# EAGLE design nunchuk-v01 (EAGLE 5.09)
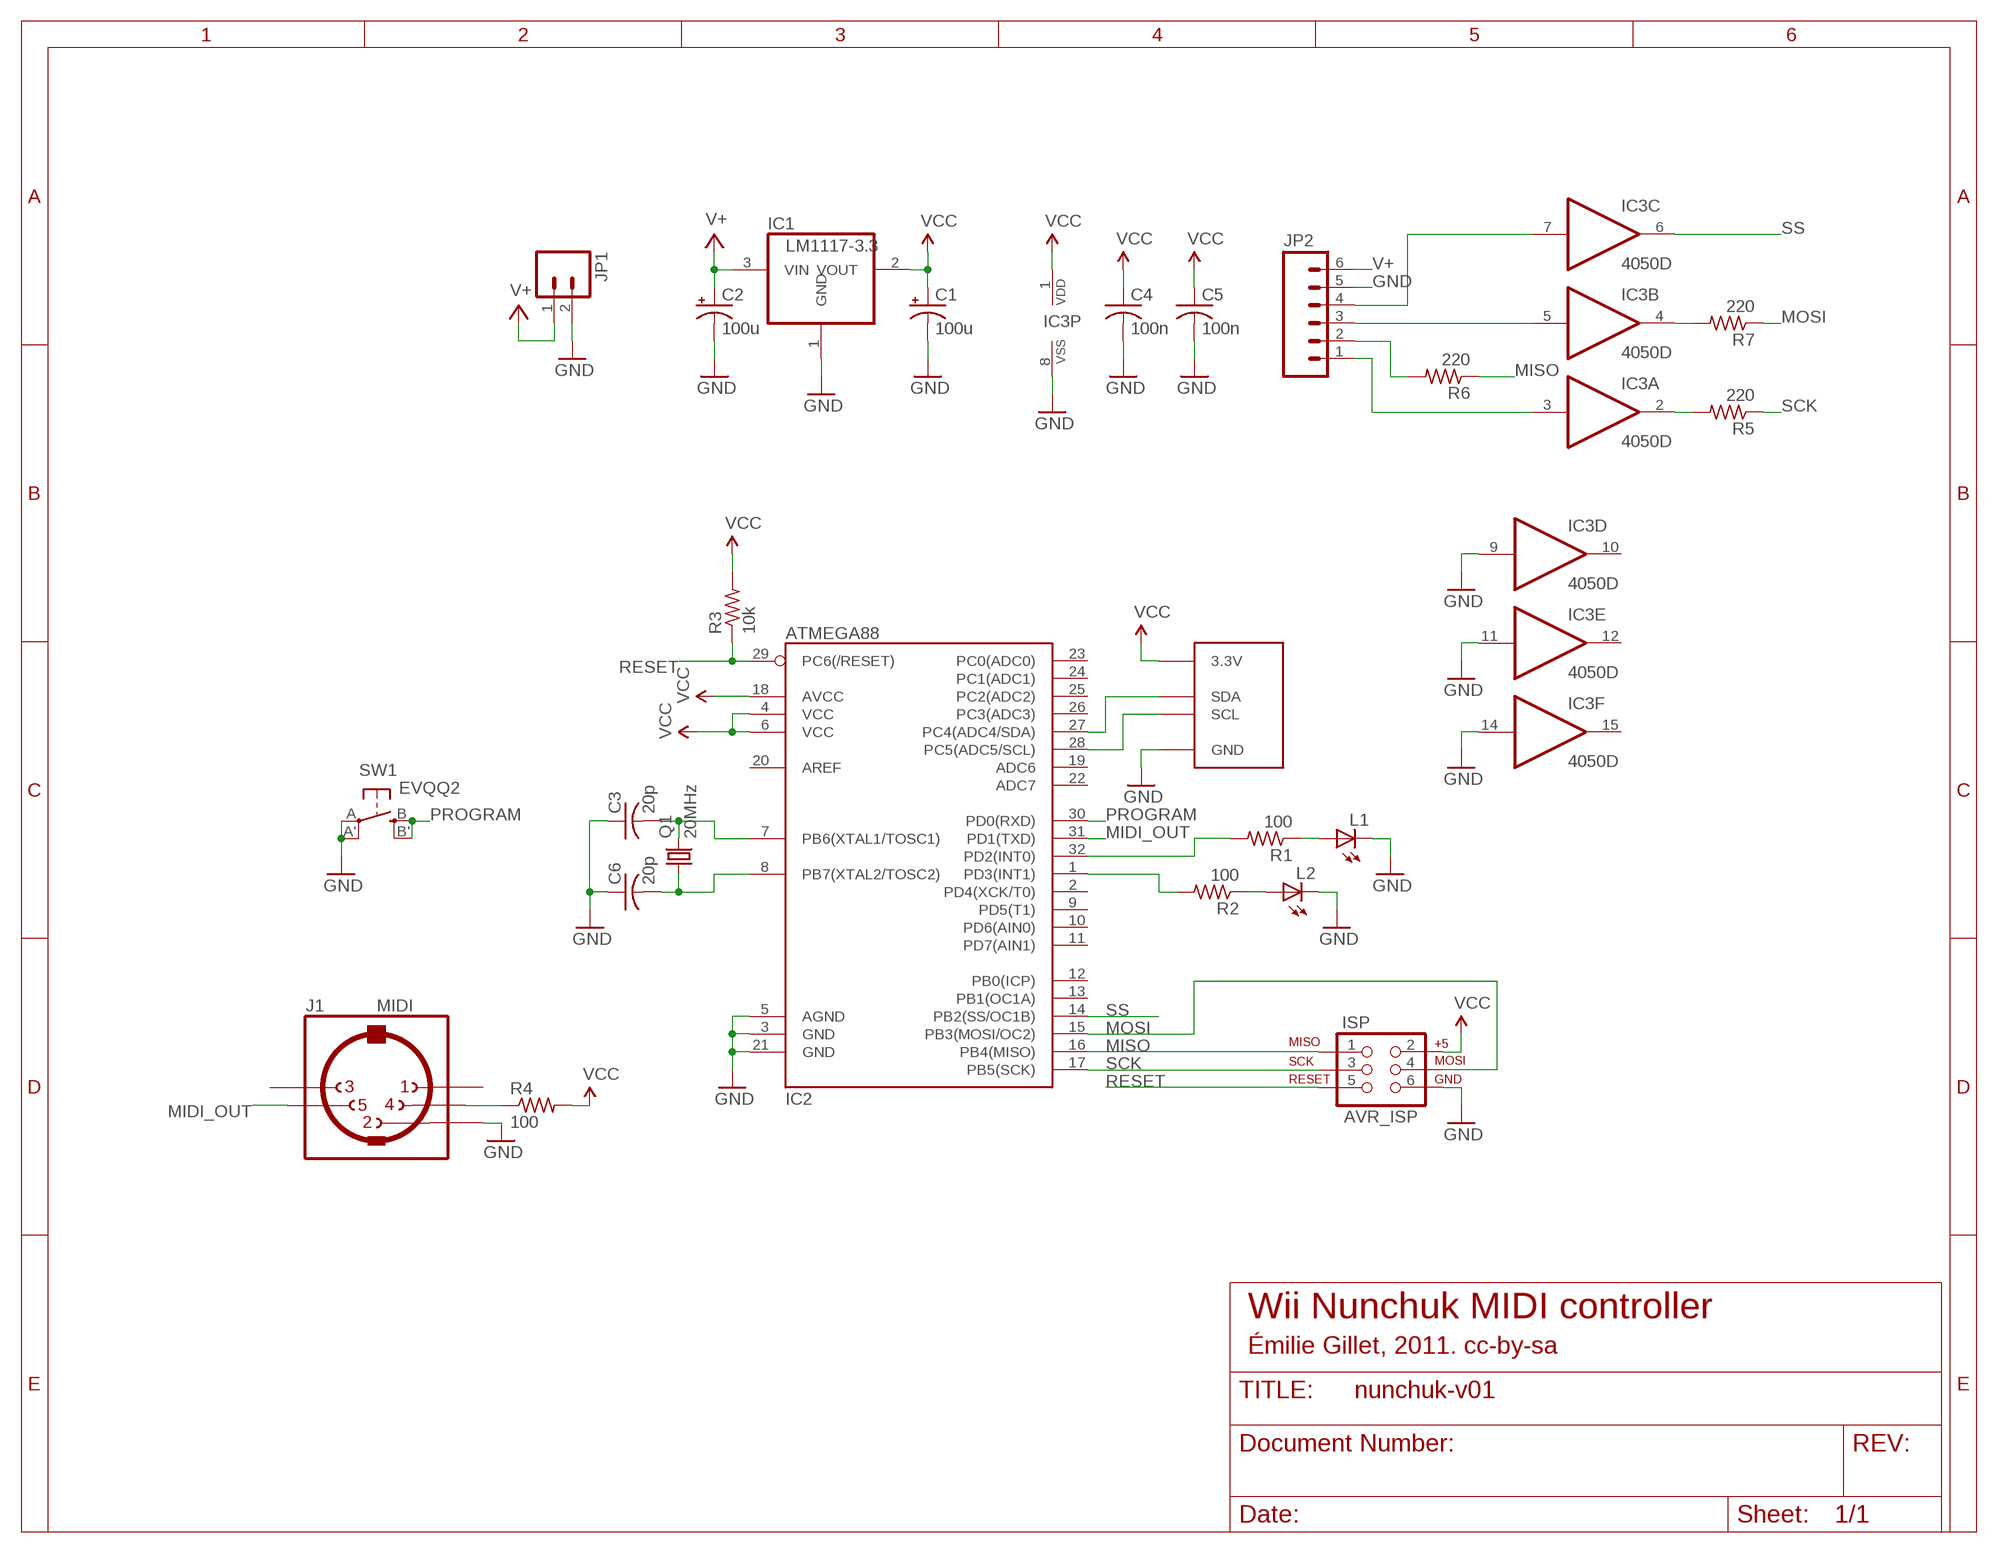
[diagram p0: schematic, sheet 1]

## Parts
C1  100u  CPOL-USD  [PANASONIC_D]
C2  100u  CPOL-USD  [PANASONIC_D]
C3  20p  C-USC0805  [C0805]
C4  100n  C-USC0805  [C0805]
C5  100n  C-USC0805  [C0805]
C6  20p  C-USC0805  [C0805]
IC1  LM1117-3.3  REG1117  [SOT223]
IC2  ATMEGA88  ATMEGA168  [TQFP32-08]
IC3  4050D  [SO16]
ISP  AVR_ISP  AVR_SPI_PRG_6PTH  [2X3]
J1  MIDI  MAB5SH  [MAB5SH]
JP1  M02  [1X02_LONGPADS]
JP2  M06SIP  [1X06]
L1  LEDCHIPLED_1206  [CHIPLED_1206]
L2  LEDCHIPLED_1206  [CHIPLED_1206]
Q1  20MHz  CRYSTALHC49UP  [HC49UP]
R1  100  R-US_R0805  [R0805]
R2  100  R-US_R0805  [R0805]
R3  10k  R-US_R0805  [R0805]
R4  100  R-US_R0805  [R0805]
R5  220  R-US_R0805  [R0805]
R6  220  R-US_R0805  [R0805]
R7  220  R-US_R0805  [R0805]
SW1  EVQQ2  [EVQ-Q2]
U$4  NUNCHUKWII_NUNCHUK  [WII_NUNCHUK]

## Nets
GND: C1.- C2.- C3.1 C4.2 C5.2 C6.1 IC1.1(GND) IC2.3(GND) IC2.5(AGND) IC2.21(GND) IC3.8(P:VSS) IC3.9(D:I) IC3.11(E:I) IC3.14(F:I) ISP.6 J1.2 JP1.2 JP2.5 L1.C L2.C SW1.A'(P1) SW1.A(P) U$4.GND
MIDI_OUT: IC2.31(PD1(TXD)) J1.5
MISO: IC2.16(PB4(MISO)) ISP.1 R6.1
MOSI: IC2.15(PB3(MOSI/OC2)) ISP.4 R7.1
N$1: IC2.32(PD2(INT0)) R1.2
N$2: IC3.5(B:I) JP2.3
N$3: JP2.2 R6.2
N$4: IC3.3(A:I) JP2.1
N$5: IC3.7(C:I) JP2.4
N$6: IC3.2(A:O) R5.2
N$7: L2.A R2.1
N$8: IC3.4(B:O) R7.2
N$9: IC2.1(PD3(INT1)) R2.2
N$14: L1.A R1.1
N$68: J1.4 R4.1
N$82: C6.2 IC2.8(PB7(XTAL2/TOSC2)) Q1.1
N$83: C3.2 IC2.7(PB6(XTAL1/TOSC1)) Q1.2
PROGRAM: IC2.30(PD0(RXD)) SW1.B'(S1) SW1.B(S)
RESET: IC2.29(PC6(/RESET)) ISP.5 R3.1
SCK: IC2.17(PB5(SCK)) ISP.3 R5.1
SCL: IC2.28(PC5(ADC5/SCL)) U$4.SCL
SDA: IC2.27(PC4(ADC4/SDA)) U$4.SDA
SS: IC2.14(PB2(SS/OC1B)) IC3.6(C:O)
V+: C2.+ IC1.3(VIN) JP1.1 JP2.6
VCC: C1.+ C4.1 C5.1 IC1.2(VOUT) IC2.4(VCC) IC2.6(VCC) IC2.18(AVCC) IC3.1(P:VDD) ISP.2 R3.2 R4.2 U$4.3.3V
Unconnected: IC2.2(PD4(XCK/T0)) IC2.9(PD5(T1)) IC2.10(PD6(AIN0)) IC2.11(PD7(AIN1)) IC2.12(PB0(ICP)) IC2.13(PB1(OC1A)) IC2.19(ADC6) IC2.20(AREF) IC2.22(ADC7) IC2.23(PC0(ADC0)) IC2.24(PC1(ADC1)) IC2.25(PC2(ADC2)) IC2.26(PC3(ADC3)) IC3.10(D:O) IC3.12(E:O) IC3.15(F:O) J1.1 J1.3

## Notes on the sheet
- Wii Nunchuk MIDI controller
- Émilie Gillet, 2011. cc-by-sa

## Library data of the parts
C1 C2 = rcl:CPOL-US: POLARIZED CAPACITOR, American symbol
C3-C6 = rcl:C-US: CAPACITOR, American symbol
IC1 = burr-brown:REG1117: 800mA and 1A Low Dropout (LDO) Positive Regulator 1.8V, 2.5V, 2.85V, 3.3V, 5V, and Adj
IC2 = SparkFun:ATMEGA168
IC3 = 40xx:4050: Hex non-inverting BUFFER
ISP = SparkFun:AVR_SPI_PRG_6: AVR ISP 6 Pin This is the reduced ISP connector for AVR programming. Common on Arduino. This footprint will take up less PCB space and can be used with a 10-pin to 6-pin adapter such as SKU: BOB-08508
J1 = og-midi:MAB5SH: Female CONNECTOR 5 pins 90 deg. with shield, horizontal (DIN 41524)
JP1 = SparkFun:M02: Header 2 Standard 2-pin 0.1" header. Use with straight break away headers (SKU : PRT-00116), right angle break away headers (PRT-00553), swiss pins (PRT-00743), machine pins (PRT-00117), and female headers (PRT-00115). Molex polarized connector foot print use with SKU : PRT-08233 with associated crimp pins and housings.
JP2 = SparkFun:M06: Header 6 Standard 6-pin 0.1" header. Use with straight break away headers (SKU : PRT-00116), right angle break away headers (PRT-00553), swiss pins (PRT-00743), machine pins (PRT-00117), and female headers (PRT-00115). Molex polarized connector foot print use with SKU : PRT-08094 with associated crimp pins and housings. NOTES ON THE VARIANTS LOCK and LOCK_LONGPADS... This footprint was designed to help hold the alignment of a through-hole component (i.e. 6-pin header) while soldering it into place. You may notice that each hole has been shifted either up or down by 0.005 of an inch from it's more standard position (which is a perfectly straight line). This slight alteration caused the pins (the squares in the middle) to touch the edges of the holes. Because they are alternating, it causes a "brace" to hold the component in place. 0.005 has proven to be the perfect amount of "off-center" position when using our standard breakaway headers. Although looks a little odd when you look at the bare footprint, once you have a header in there, the alteration is very hard to notice. Also, if you push a header all the way into place, it is covered up entirely on the bottom side. This idea of altering the position of holes to aid alignment will be further integrated into the Sparkfun Library for other footprints. It can help hold any component with 3 or more connection pins.
L1 L2 = led:LED: LED OSRAM: - CHIPLED LG R971, LG N971, LY N971, LG Q971, LY Q971, LO R971, LY R971 LH N974, LH R974 LS Q976, LO Q976, LY Q976 LO Q996 - Hyper CHIPLED LW Q18S LB Q993, LB Q99A, LB R99A - SideLED LS A670, LO A670, LY A670, LG A670, LP A670 LB A673, LV A673, LT A673, LW A673 LH A674 LY A675 LS A676, LA A676, LO A676, LY A676, LW A676 LS A679, LY A679, LG A679 - Hyper Micro SIDELED® LS Y876, LA Y876, LO Y876, LY Y876 LT Y87S - SmartLED LW L88C, LW L88S LB L89C, LB L89S, LG L890 LS L89K, LO L89K, LY L89K LS L896, LA L896, LO L896, LY L896 - TOPLED LS T670, LO T670, LY T670, LG T670, LP T670 LSG T670, LSP T670, LSY T670, LOP T670, LYG T670 LG T671, LOG T671, LSG T671 LB T673, LV T673, LT T673, LW T673 LH T674 LS T676, LA T676, LO T676, LY T676, LB T676, LH T676, LSB T676, LW T676 LB T67C, LV T67C, LT T67C, LS T67K, LO T67K, LY T67K, LW E67C LS E67B, LA E67B, LO E67B, LY E67B, LB E67C, LV E67C, LT E67C LW T67C LS T679, LY T679, LG T679 LS T770, LO T770, LY T770, LG T770, LP T770 LB T773, LV T773, LT T773, LW T773 LH T774 LS E675, LA E675, LY E675, LS T675 LS T776, LA T776, LO T776, LY T776, LB T776 LHGB T686 LT T68C, LB T68C - Hyper Mini TOPLED® LB M676 - Mini TOPLED Santana® LG M470 LS M47K, LO M47K, LY M47K Source: http://www.osram.convergy.de LUXEON: - LUMILED® LXK2-PW12-R00, LXK2-PW12-S00, LXK2-PW14-U00, LXK2-PW14-V00 LXK2-PM12-R00, LXK2-PM12-S00, LXK2-PM14-U00 LXK2-PE12-Q00, LXK2-PE12-R00, LXK2-PE12-S00, LXK2-PE14-T00, LXK2-PE14-U00 LXK2-PB12-K00, LXK2-PB12-L00, LXK2-PB12-M00, LXK2-PB14-N00, LXK2-PB14-P00, LXK2-PB14-Q00 LXK2-PR12-L00, LXK2-PR12-M00, LXK2-PR14-Q00, LXK2-PR14-R00 LXK2-PD12-Q00, LXK2-PD12-R00, LXK2-PD12-S00 LXK2-PH12-R00, LXK2-PH12-S00 LXK2-PL12-P00, LXK2-PL12-Q00, LXK2-PL12-R00 Source: www.luxeon.com KINGBRIGHT: KA-3528ASYC Source: www.kingbright.com
Q1 = crystal:CRYSTAL: CRYSTAL
R1-R7 = rcl:R-US_: RESISTOR, American symbol
SW1 = adafruit:EVQQ2: SMT 6mm switch, EVQQ2 series http://www.ladyada.net/library/eagle
U$4 = og-nunchuk:NUNCHUK

## Board
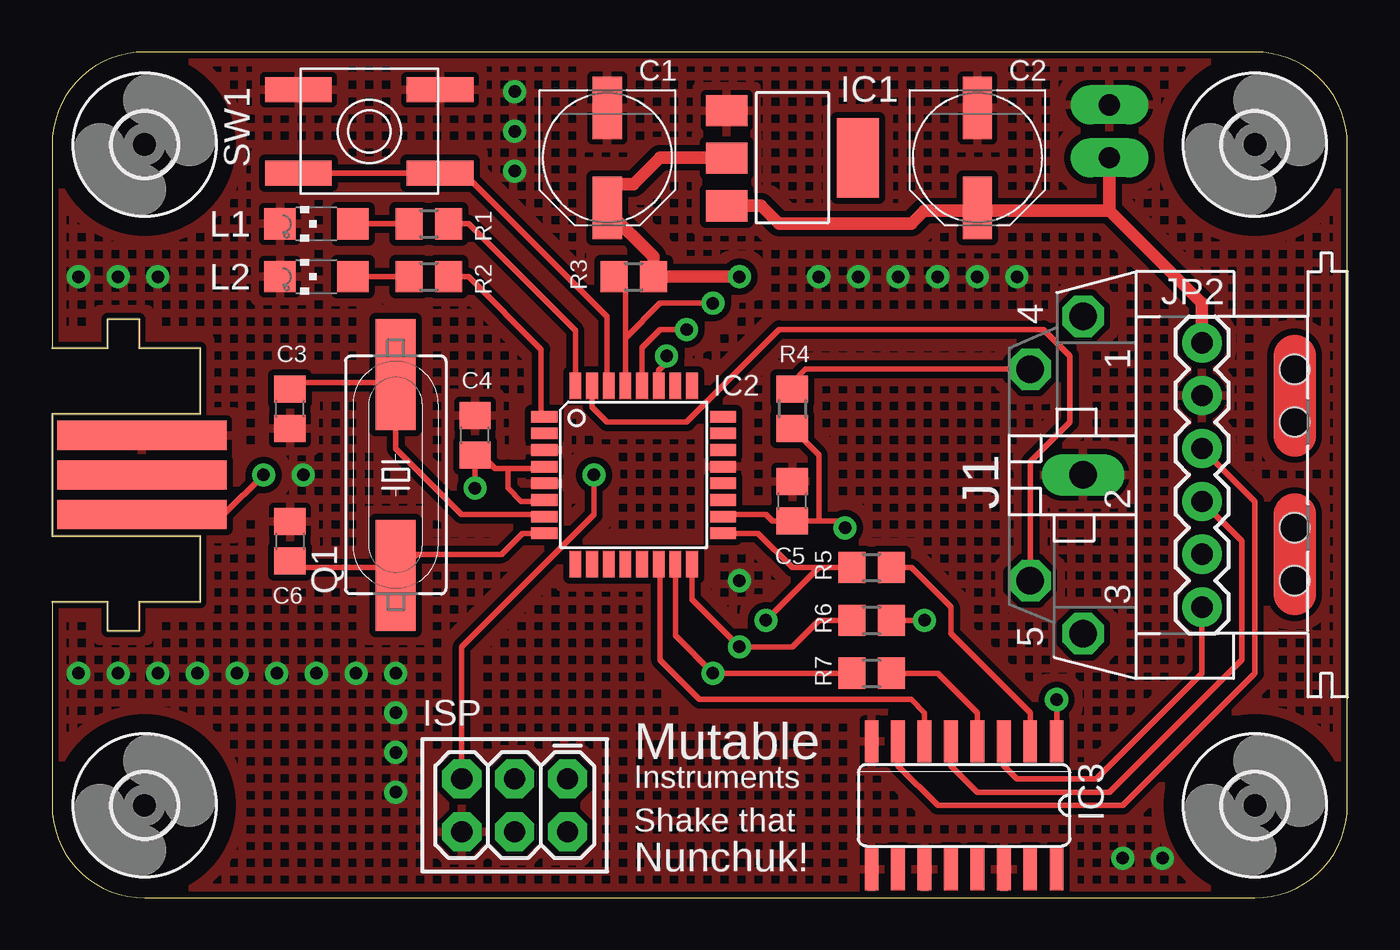
[diagram p1: board, top side]
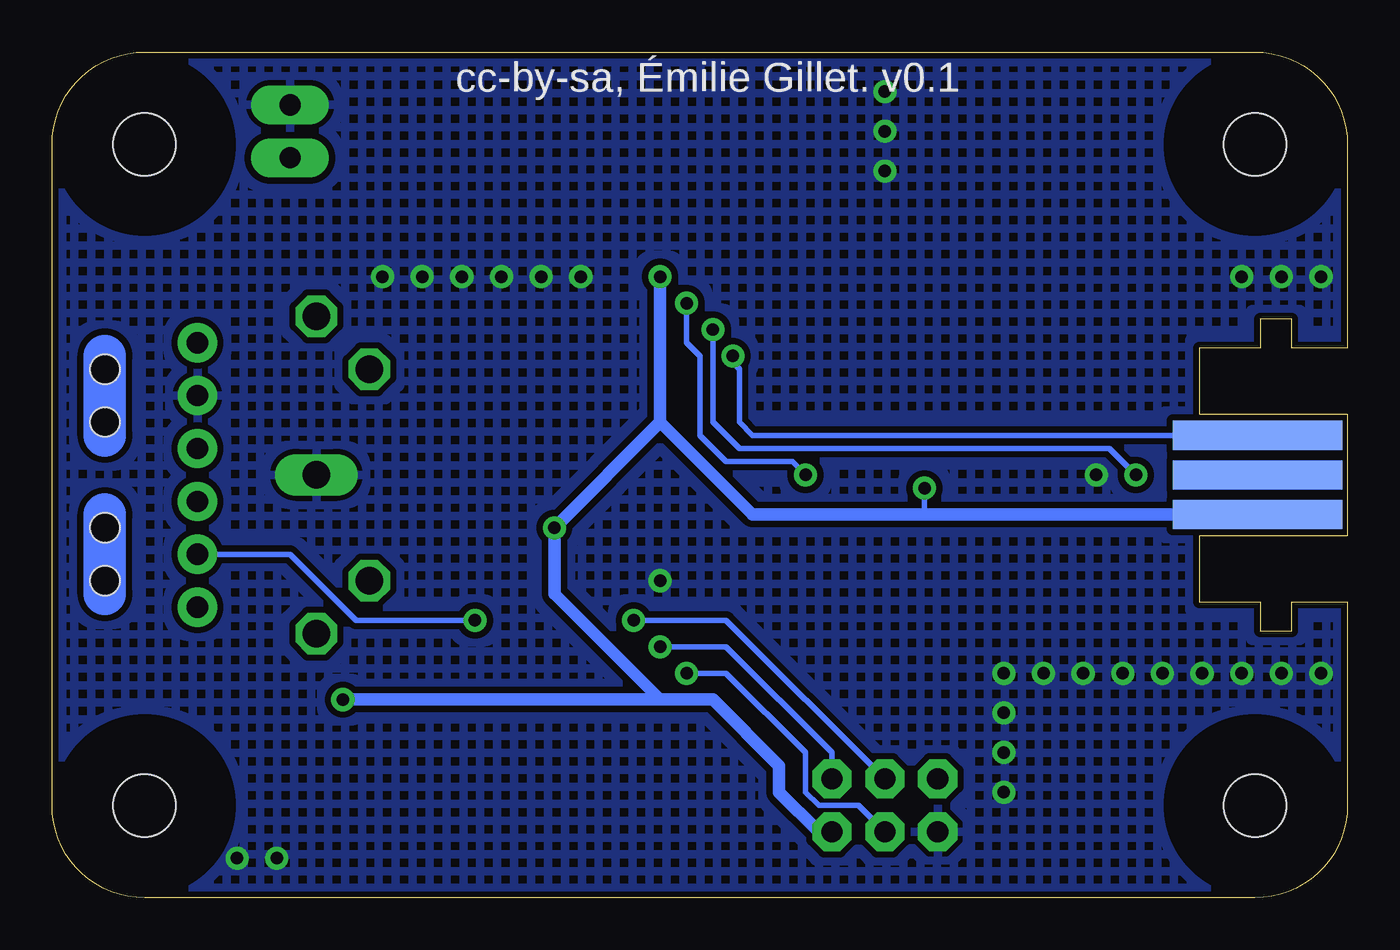
[diagram p2: board, bottom side, seen from below]

Size 62.23 x 40.64 mm. Coordinates in mm from the lower left corner, seen from the top.
Outline: 4.45,40.64 arc90 0,36.2 0,26.42 2.67,26.42 2.67,27.81 4.19,27.81 4.19,26.42 7.11,26.42 7.11,23.24 0,23.24 0,17.4 7.11,17.4 7.11,14.22 4.19,14.22 4.19,12.83 2.67,12.83 2.67,14.22 0,14.22 0,4.45 arc90 4.45,0 57.78,0 arc90 62.23,4.45 62.23,36.2 arc90 57.78,40.64 4.45,40.64
Copper layers (1*16): Top 0.035mm / dielectric 1.5mm / Bottom 0.035mm
Design rules "SparkFun": minimum track width 8mil, minimum drill 20mil, track to track 8mil, track to pad 8mil, pad to pad 8mil, via to via 8mil, smd to smd 8mil, copper to edge 10mil, drill to drill 8mil, minimum pad ring 12mil, minimum via ring 10mil, stop-mask expansion 4mil, vias tented up to drill 25mil, thermal gap 10mil

### Footprints (pad centres in the part's own frame; a part is rotated, then mirrored left to right if it is on the bottom)
PANASONIC_D = smd 3 x 1.4: + 2.4,0; - -2.4,0
C0805 = smd 1.3 x 1.5: 1 -0.95,0; 2 0.95,0
SOT223 = smd 1.499 x 2.007: 1 -2.261,-3.15; 2 0.025,-3.15; 3 2.311,-3.15 | smd 3.81 x 2.007: 4 0,3.15
TQFP32-08 = smd 1.27 x 0.559: 1 -4.293,2.8; 2 -4.293,2; 3 -4.293,1.2; 4 -4.293,0.4; 5 -4.293,-0.4; 6 -4.293,-1.2; 7 -4.293,-2; 8 -4.293,-2.8; 17 4.293,-2.8; 18 4.293,-2; 19 4.293,-1.2; 20 4.293,-0.4; 21 4.293,0.4; 22 4.293,1.2; 23 4.293,2; 24 4.293,2.8 | smd 0.559 x 1.27: 9 -2.8,-4.293; 10 -2,-4.293; 11 -1.2,-4.293; 12 -0.4,-4.293; 13 0.4,-4.293; 14 1.2,-4.293; 15 2,-4.293; 16 2.8,-4.293; 25 2.8,4.293; 26 2,4.293; 27 1.2,4.293; 28 0.4,4.293; 29 -0.4,4.293; 30 -1.2,4.293; 31 -2,4.293; 32 -2.8,4.293
SO16 = smd 0.66 x 2.032: 1 -4.445,-3.073; 2 -3.175,-3.073; 3 -1.905,-3.073; 4 -0.635,-3.073; 5 0.635,-3.073; 6 1.905,-3.073; 7 3.175,-3.073; 8 4.445,-3.073; 9 4.445,3.073; 10 3.175,3.073; 11 1.905,3.073; 12 0.635,3.073; 13 -0.635,3.073; 14 -1.905,3.073; 15 -3.175,3.073; 16 -4.445,3.073
2X3 = drill 1.016 pad 1.88 octagon: 1 0,0; 2 0,2.54; 3 2.54,0; 4 2.54,2.54; 5 5.08,0; 6 5.08,2.54
MAB5SH = drill 1.321 octagon: 1 7.62,7.62; 3 -7.62,7.62; 4 5.08,10.16; 5 -5.08,10.16 | drill 1.321 long: 2 0,7.62 | hole 1.4: 2.54,-2.54; -2.54,-2.54; -5.08,-2.54; 5.08,-2.54
1X02_LONGPADS = drill 1.016 pad 1.88 long: 1 0,0; 2 2.54,0
1X06 = drill 1.016 pad 1.88 round: 1 0,0; 2 2.54,0; 3 5.08,0; 4 7.62,0; 5 10.16,0; 6 12.7,0
CHIPLED_1206 = smd 1.5 x 1.5: A 0,-1.75; C 0,1.75
HC49UP = smd 5.334 x 1.93: 1 -4.826,0; 2 4.826,0
R0805 = smd 1.3 x 1.5: 1 -0.95,0; 2 0.95,0
EVQ-Q2 = smd 3.2 x 1.2: A -3.4,-2; A' 3.4,-2; B -3.4,2; B' 3.4,2
3,0 = hole 3: 0,0
WII_NUNCHUK = smd 1.397 x 8.128 bottom: 3.3V 1.905,4.318; NC1 0,4.318; SDA -1.905,4.318 | smd 1.397 x 8.128: GND -1.905,4.318; NC2 0,4.318; SCL 1.905,4.318

### Placement (x,y rotation side)
C1  26.67,35.56 270 top
C2  44.45,35.56 270 top
C3  11.43,23.5 90 top
C4  20.32,22.22 90 top
C5  35.56,19.05 90 top
C6  11.43,17.14 270 top
IC1  35.56,35.56 270 top
IC2  27.94,20.32 0 top
IC3  43.81,4.45 180 top
ISP  24.77,5.71 180 top
J1  57.15,20.32 90 top
JP1  50.8,35.56 90 top
JP2  55.25,13.97 90 top
L1  12.7,32.38 90 top
L2  12.7,29.84 90 top
Q1  16.51,20.32 90 top
R1  18.1,32.38 0 top
R2  18.1,29.84 0 top
R3  27.94,29.84 0 top
R4  35.56,23.5 270 top
R5  39.37,15.88 0 top
R6  39.37,13.33 0 top
R7  39.37,10.79 0 top
SW1  15.24,36.83 180 top
U$1  [3,0]  4.45,36.2 0 top
U$2  [3,0]  57.78,36.2 0 top
U$3  [PLATYPUS]  9.52,31.11 270 top
U$4  0,20.32 270 top
U$5  [3,0]  4.45,4.45 0 top
U$6  [3,0]  57.78,4.45 0 top
U$7  [SARASWATI_TINY]  8.25,1.27 0 top

### Tracks (layer width: path | path; a pad name or v marks a point on that pad's centre or on a via)
GND  (via drill 0.6)
  other vias: 33.02,15.24 12.06,20.32 1.27,29.84 3.17,29.84 5.08,29.84 5.08,10.79 3.17,10.79 1.27,10.79 51.44,1.91 53.34,1.91 46.36,29.84 44.45,29.84 42.55,29.84 40.64,29.84 22.22,38.74 22.22,36.83 22.22,34.93 38.73,29.84 36.83,29.84 16.51,10.79 16.51,8.89 16.51,6.98 6.98,10.79 8.89,10.79 10.79,10.79 12.7,10.79 14.6,10.79 16.51,5.08
  pour Top (isolate 0.305, hatched): 0,40.64 0,0 62.23,0 62.23,40.64
  pour Bottom (isolate 0.305, hatched): 0,0 62.23,0 62.23,40.64 0,40.64
MIDI_OUT
  Top 0.254: IC2.31 25.94,23.59 26.67,22.86 30.48,22.86 34.92,27.3 47.62,27.3 48.89,26.04 48.89,22.86 46.99,20.95 J1.5
MISO  (via drill 0.6)
  Top 0.254: IC2.16 30.74,14.34 v33.02,12.06 35.56,12.06 36.83,13.33 R6.1
  Bottom 0.254: v33.02,12.06 29.84,12.06 24.77,6.98 ISP.1
MOSI  (via drill 0.6)
  Top 0.254: IC2.15 29.94,12.61 v31.75,10.79 R7.1
  Bottom 0.254: ISP.4 23.49,4.45 25.4,4.45 26.03,5.08 26.03,6.98 29.84,10.79 v31.75,10.79
N$1
  Top 0.254: R1.2 20,32.38 25.14,27.25 IC2.32
N$2
  Top 0.254: JP2.3 57.15,17.14 57.15,11.43 50.8,5.08 44.45,5.08 43.18,6.35 IC3.5
N$3  (via drill 0.6)
  Top 0.254: R6.2 v41.91,13.33
  Bottom 0.254: v41.91,13.33 47.62,13.33 50.8,16.51 JP2.2
N$4
  Top 0.254: IC3.3 45.72,6.35 46.36,5.71 50.16,5.71 55.25,10.79 JP2.1
N$5
  Top 0.254: IC3.7 40.64,6.35 42.55,4.45 51.44,4.45 57.78,10.79 57.78,19.05 JP2.4
N$6
  Top 0.254: IC3.2 46.99,8.89 43.18,12.7 43.18,13.97 41.27,15.88 R5.2
N$7
  Top 0.254: L2.A R2.1
N$8
  Top 0.254: R7.2 42.55,10.79 44.45,8.89 IC3.4
N$9
  Top 0.254: IC2.1 23.49,23.27 23.49,26.35 20,29.84 R2.2
N$14
  Top 0.254: L1.A R1.1
N$68
  Top 0.254: J1.4 36.19,25.4 35.56,24.77 R4.1
N$82
  Top 0.254: C6.2 11.75,15.88 15.88,15.88 16.26,15.49 Q1.1 17.53,16.51 21.59,16.51 22.6,17.52 IC2.8
N$83
  Top 0.254: C3.2 11.75,24.77 15.88,24.77 16.26,25.15 Q1.2 16.51,21.59 19.68,18.41 23.55,18.41 IC2.7
PROGRAM
  Top 0.254: SW1.B' SW1.B 19.78,34.83 26.67,27.94 26.67,24.68 IC2.30
RESET  (via drill 0.6)
  Top 0.254: v31.75,28.57 29.21,28.57 27.54,26.91 | v26.03,20.32 26.03,18.41 19.68,12.06 ISP.5 | 27.54,26.91 27.54,26.67 IC2.29 | R3.1 27.54,29.29 27.54,26.91
  Bottom 0.254: v31.75,28.57 31.75,26.67 31.11,26.04 31.11,22.22 29.84,20.95 26.67,20.95 v26.03,20.32
SCK  (via drill 0.6)
  Top 0.254: IC2.17 33.91,17.52 35.56,15.88 36.83,15.88 | 36.83,15.88 R5.1 | v34.29,13.33 36.83,15.88
  Bottom 0.254: v34.29,13.33 29.84,13.33 ISP.3
SCL  (via drill 0.6)
  Top 0.254: U$4.SCL 8.25,18.41 v10.16,20.32 | v30.48,27.3 29.21,27.3 28.34,26.43 IC2.28
  Bottom 0.254: v10.16,20.32 11.43,21.59 29.21,21.59 30.48,22.86 v30.48,27.3
SDA  (via drill 0.6)
  Top 0.254: v29.53,26.04 29.53,25.72 29.14,25.33 IC2.27
  Bottom 0.254: U$4.SDA 28.58,22.22 29.21,22.86 29.21,25.4 29.53,25.72 v29.53,26.04
SS
  Top 0.254: IC2.14 29.21,15.96 29.21,11.43 31.11,9.53 41.27,9.53 41.91,8.89 IC3.6
V+
  Top 0.61: IC1.3 34.06,33.25 34.92,32.38 41.27,32.38 41.91,33.02 44.31,33.02 C2.+ 44.59,33.02 50.8,33.02 | 50.8,33.02 JP1.1 | 50.8,33.02 55.25,28.57 JP2.6
VCC  (via drill 0.6)
  Top 0.254: 32.14,18.41 IC2.18 32.33,18.41 34.29,18.41 34.61,18.1 C5.1 36.83,18.1 | v20.32,19.68 C4.1 20.63,21.27 21.27,20.64 21.91,20.64 | IC2.4 23.56,20.64 21.91,20.64 | R4.2 36.83,21.27 36.83,18.1 | 36.83,18.1 37.78,18.1 v38.1,17.78 | IC2.6 23.58,19.05 22.54,19.05 21.91,19.68 21.91,20.64 | v48.26,9.53 IC3.1
  Top 0.61: IC1.2 32.38,35.56 29.21,35.56 27.94,34.29 26.67,34.29 C1.+ 26.67,33.02 28.89,30.8 R3.2 v33.02,29.84
  Bottom 0.254: 20.32,18.41 v20.32,19.68
  Bottom 0.61: U$4.3.3V 20.32,18.41 28.58,18.41 33.02,22.86 | 33.02,22.86 v33.02,29.84 | 33.02,22.86 v38.1,17.78 38.1,14.61 33.02,9.53 | ISP.2 25.4,3.17 27.3,5.08 27.3,6.35 30.48,9.53 33.02,9.53 | 33.02,9.53 v48.26,9.53

### Text on the board
tNames: Mutable | Instruments | Shake that | Nunchuk!
bNames: cc-by-sa, Émilie Gillet. v0.1